# EAGLE schematic Esquematico_Blue_Pill (EAGLE 9.6.2)
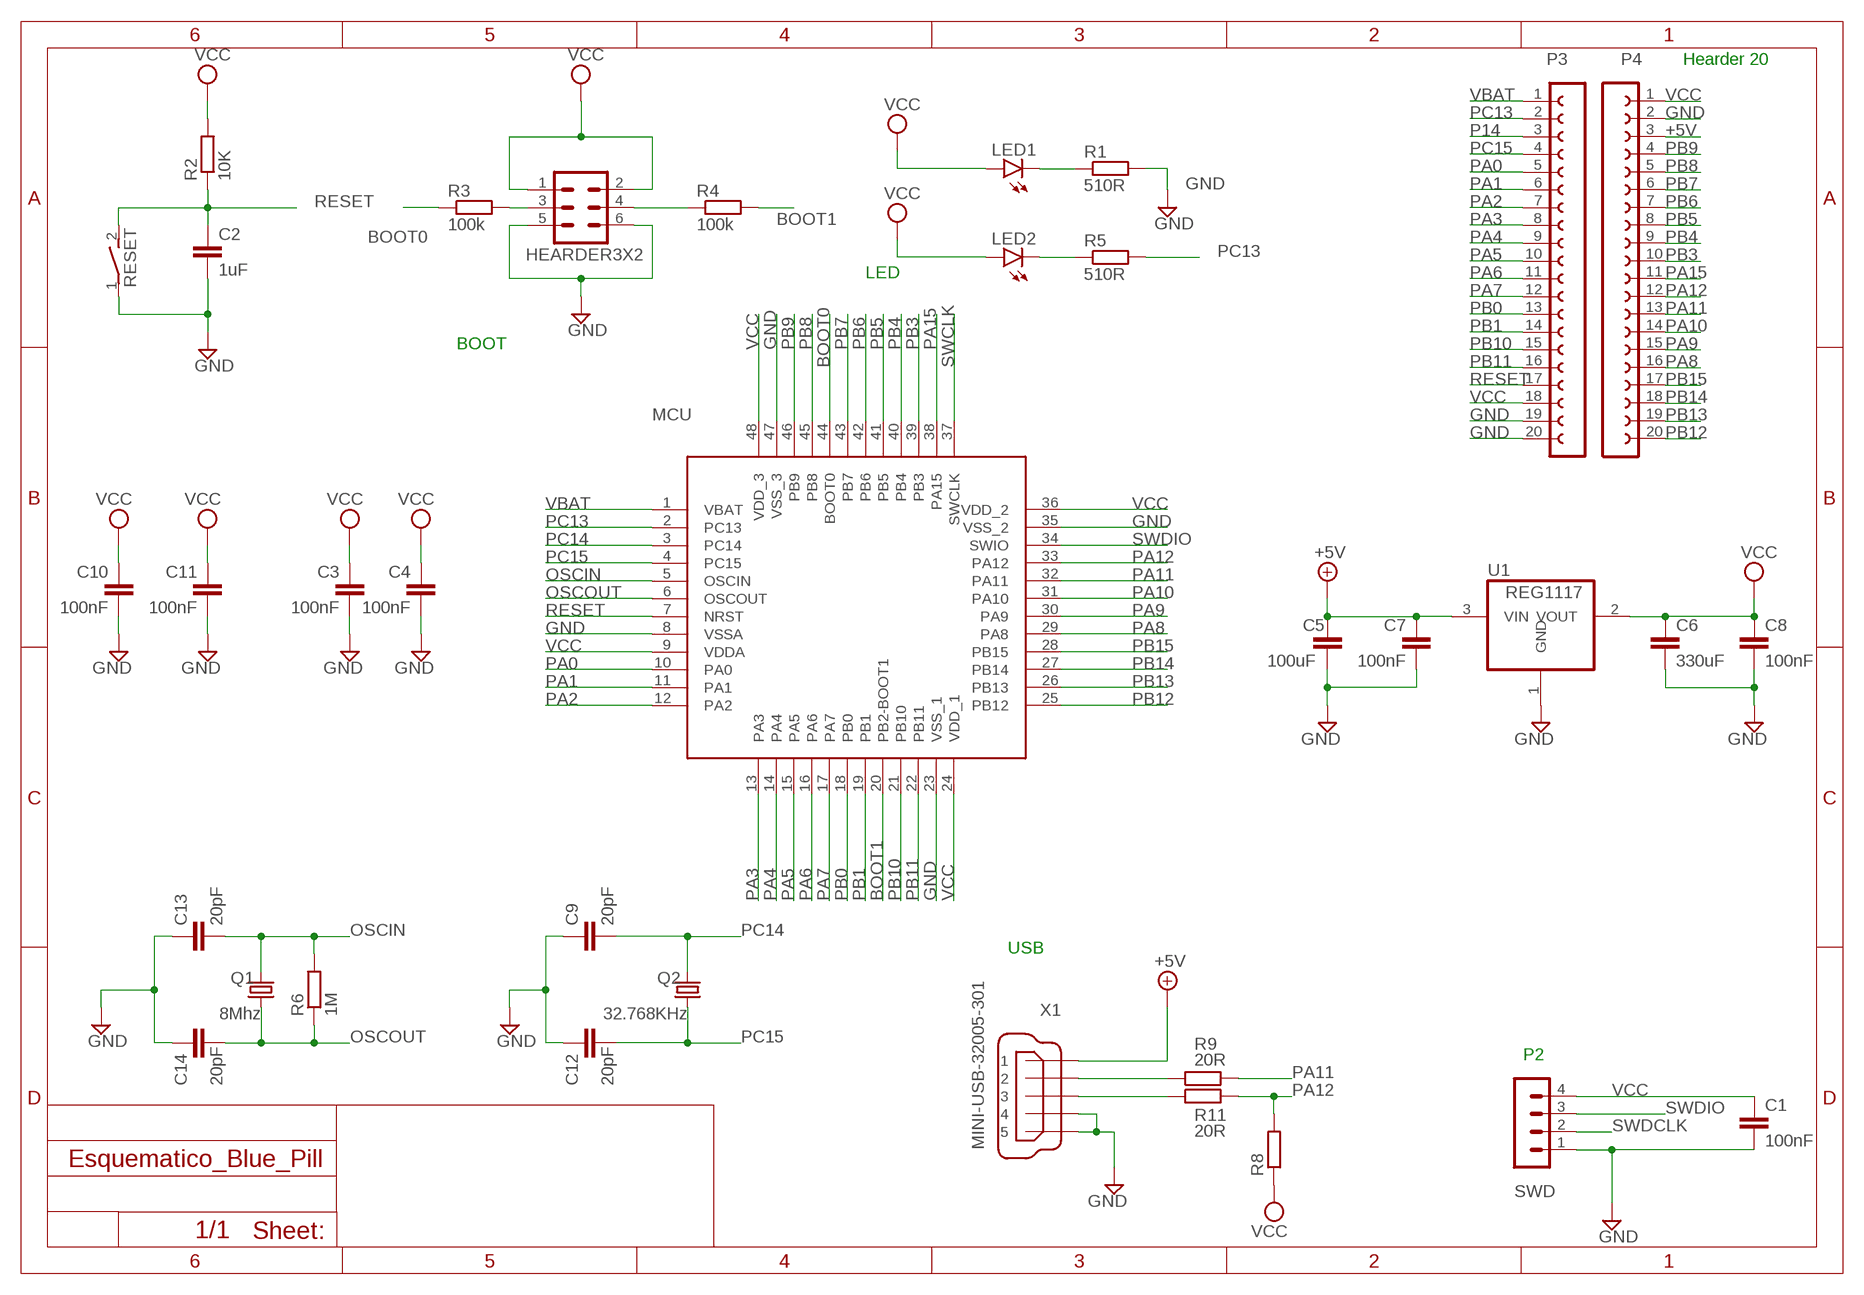
[diagram p0: schematic, sheet 1]

## Parts
C1  100nF  C2.5/2  [C2.5-2]
C2  1uF  C2,5-3  [C2.5-3]
C3  100nF  C2.5/2  [C2.5-2]
C4  100nF  C2.5/2  [C2.5-2]
C5  100uF  C2.5/2  [C2.5-2]
C6  330uF  C2.5/2  [C2.5-2]
C7  100nF  C2.5/2  [C2.5-2]
C8  100nF  C2.5/2  [C2.5-2]
C9  20pF  C2.5/2  [C2.5-2]
C10  100nF  C2.5/2  [C2.5-2]
C11  100nF  C2.5/2  [C2.5-2]
C12  20pF  C2.5/2  [C2.5-2]
C13  20pF  C2.5/2  [C2.5-2]
C14  20pF  C2.5/2  [C2.5-2]
HEARDER3X2  MA03-2  [MA03-2]
LED1  LED3MM  [LED3MM]
LED2  LED3MM  [LED3MM]
MCU  STM32F103C8T6F103C8T6  [STM32]
P3  FE20-1  [FE20]
P4  FE20-1  [FE20]
Q1  8Mhz  CRYSTALHC49S  [HC49/S]
Q2  32.768KHz  CRYSTALHC49S  [HC49/S]
R1  510R  R-EU_0204/5  [0204/5]
R2  10K  R-EU_0204/7  [0204/7]
R3  100k  R-EU_0204/5  [0204/5]
R4  100k  R-EU_0204/5  [0204/5]
R5  510R  R-EU_0204/5  [0204/5]
R6  1M  R-EU_0204/5  [0204/5]
R8  R-EU_0204/5  [0204/5]
R9  20R  R-EU_0204/5  [0204/5]
R11  20R  R-EU_0204/5  [0204/5]
RESET  DS01E  [DS-01]
SWD  MA04-1  [MA04-1]
U1  REG1117  [SOT223]
X1  MINI-USB-32005-301  [32005-301]

## Nets
+5V: C5.1 C7.1 P4.3 U1.3(VIN) X1.1
BOOT0: MCU.44(BOOT0) R3.1
BOOT1: MCU.20(PB2-BOOT1) R4.2
GND: C1.2 C2.2 C3.2 C4.2 C5.2 C6.2 C7.2 C8.2 C9.1 C10.2 C11.2 C12.1 C13.1 C14.1 HEARDER3X2.5 HEARDER3X2.6 MCU.8(VSSA) MCU.23(VSS_1) MCU.35(VSS_2) MCU.47(VSS_3) P3.19 P3.20 P4.2 R1.2 RESET.1 SWD.1 U1.1(GND) X1.4 X1.5
N$1: LED1.K(C) R1.1
N$3: LED2.K(C) R5.1
N$4: HEARDER3X2.4 R4.1
N$5: HEARDER3X2.3 R3.2
N$9: R9.1 X1.2
N$10: R11.1 X1.3
OSCIN: C13.2 MCU.5(OSCIN) Q1.2 R6.2
OSCOUT: C14.2 MCU.6(OSCOUT) Q1.1 R6.1
P14: P3.3
PA0: MCU.10(PA0) P3.5
PA1: MCU.11(PA1) P3.6
PA2: MCU.12(PA2) P3.7
PA3: MCU.13(PA3) P3.8
PA4: MCU.14(PA4) P3.9
PA5: MCU.15(PA5) P3.10
PA6: MCU.16(PA6) P3.11
PA7: MCU.17(PA7) P3.12
PA8: MCU.29(PA8) P4.16
PA9: MCU.30(PA9) P4.15
PA10: MCU.31(PA10) P4.14
PA11: MCU.32(PA11) P4.13 R9.2
PA12: MCU.33(PA12) P4.12 R8.2 R11.2
PA15: MCU.38(PA15) P4.11
PB0: MCU.18(PB0) P3.13
PB1: MCU.19(PB1) P3.14
PB3: MCU.39(PB3) P4.10
PB4: MCU.40(PB4) P4.9
PB5: MCU.41(PB5) P4.8
PB6: MCU.42(PB6) P4.7
PB7: MCU.43(PB7) P4.6
PB8: MCU.45(PB8) P4.5
PB9: MCU.46(PB9) P4.4
PB10: MCU.21(PB10) P3.15
PB11: MCU.22(PB11) P3.16
PB12: MCU.25(PB12) P4.20
PB13: MCU.26(PB13) P4.19
PB14: MCU.27(PB14) P4.18
PB15: MCU.28(PB15) P4.17
PC13: MCU.2(PC13) P3.2 R5.2
PC14: C9.2 MCU.3(PC14) Q2.2
PC15: C12.2 MCU.4(PC15) P3.4 Q2.1
RESET: C2.1 MCU.7(NRST) P3.17 R2.1 RESET.2
SWCLK: MCU.37(SWCLK)
SWDCLK: SWD.2
SWDIO: MCU.34(SWIO) SWD.3
VBAT: MCU.1(VBAT) P3.1
VCC: C1.1 C3.1 C4.1 C6.1 C8.1 C10.1 C11.1 HEARDER3X2.1 HEARDER3X2.2 LED1.A LED2.A MCU.9(VDDA) MCU.24(VDD_1) MCU.36(VDD_2) MCU.48(VDD_3) P3.18 P4.1 R2.2 R8.1 SWD.4 U1.2(VOUT)

## Notes on the sheet
- Hearder 20
- LED
- BOOT
- USB
- P2

## Library data of the parts
C1-C14 = capacitor-wima:C: CAPACITOR naming: grid - package width
HEARDER3X2 = con-lstb:MA03-2: PIN HEADER; OC_FARNELL: unknown; OC_NEWARK: unknown
LED1 LED2 = led:LED: LED OSRAM: - CHIPLED LG R971, LG N971, LY N971, LG Q971, LY Q971, LO R971, LY R971 LH N974, LH R974 LS Q976, LO Q976, LY Q976 LO Q996 - Hyper CHIPLED LW Q18S LB Q993, LB Q99A, LB R99A - SideLED LS A670, LO A670, LY A670, LG A670, LP A670 LB A673, LV A673, LT A673, LW A673 LH A674 LY A675 LS A676, LA A676, LO A676, LY A676, LW A676 LS A679, LY A679, LG A679 - Hyper Micro SIDELED® LS Y876, LA Y876, LO Y876, LY Y876 LT Y87S - SmartLED LW L88C, LW L88S LB L89C, LB L89S, LG L890 LS L89K, LO L89K, LY L89K LS L896, LA L896, LO L896, LY L896 - TOPLED LS T670, LO T670, LY T670, LG T670, LP T670 LSG T670, LSP T670, LSY T670, LOP T670, LYG T670 LG T671, LOG T671, LSG T671 LB T673, LV T673, LT T673, LW T673 LH T674 LS T676, LA T676, LO T676, LY T676, LB T676, LH T676, LSB T676, LW T676 LB T67C, LV T67C, LT T67C, LS T67K, LO T67K, LY T67K, LW E67C LS E67B, LA E67B, LO E67B, LY E67B, LB E67C, LV E67C, LT E67C LW T67C LS T679, LY T679, LG T679 LS T770, LO T770, LY T770, LG T770, LP T770 LB T773, LV T773, LT T773, LW T773 LH T774 LS E675, LA E675, LY E675, LS T675 LS T776, LA T776, LO T776, LY T776, LB T776 LHGB T686 LT T68C, LB T68C - Hyper Mini TOPLED® LB M676 - Mini TOPLED Santana® LG M470 LS M47K, LO M47K, LY M47K Source: http://www.osram.convergy.de LUXEON: - LUMILED® LXK2-PW12-R00, LXK2-PW12-S00, LXK2-PW14-U00, LXK2-PW14-V00 LXK2-PM12-R00, LXK2-PM12-S00, LXK2-PM14-U00 LXK2-PE12-Q00, LXK2-PE12-R00, LXK2-PE12-S00, LXK2-PE14-T00, LXK2-PE14-U00 LXK2-PB12-K00, LXK2-PB12-L00, LXK2-PB12-M00, LXK2-PB14-N00, LXK2-PB14-P00, LXK2-PB14-Q00 LXK2-PR12-L00, LXK2-PR12-M00, LXK2-PR14-Q00, LXK2-PR14-R00 LXK2-PD12-Q00, LXK2-PD12-R00, LXK2-PD12-S00 LXK2-PH12-R00, LXK2-PH12-S00 LXK2-PL12-P00, LXK2-PL12-Q00, LXK2-PL12-R00 Source: www.luxeon.com KINGBRIGHT: KA-3528ASYC Source: www.kingbright.com
MCU = stm32:STM32F103C8T6
P3 P4 = con-lsta:FE20-1: FEMALE HEADER; OC_FARNELL: unknown; OC_NEWARK: unknown
Q1 Q2 = crystal:CRYSTAL: CRYSTAL; OC_FARNELL: 1667008; OC_NEWARK: unknown
R1-R6 R8 R9 R11 = rcl:R-EU_: RESISTOR, European symbol; SPICEPREFIX: R
RESET = switch-dil:DS01E: DIL/CODE SWITCH; OC_FARNELL: unknown; OC_NEWARK: unknown
SWD = con-lstb:MA04-1: PIN HEADER; OC_FARNELL: unknown; OC_NEWARK: unknown
U1 = burr-brown:REG1117: 800mA and 1A Low Dropout (LDO) Positive Regulator 1.8V, 2.5V, 2.85V, 3.3V, 5V, and Adj; MPN: REG1117; OC_FARNELL: 1097566; OC_NEWARK: 14P6981
X1 = con-cypressindustries:MINI-USB-: MINI USB-B Conector Source: www.cypressindustries.com; OC_FARNELL: unknown; OC_NEWARK: unknown